# Altium schematic sheet Top.SchDoc
size A4
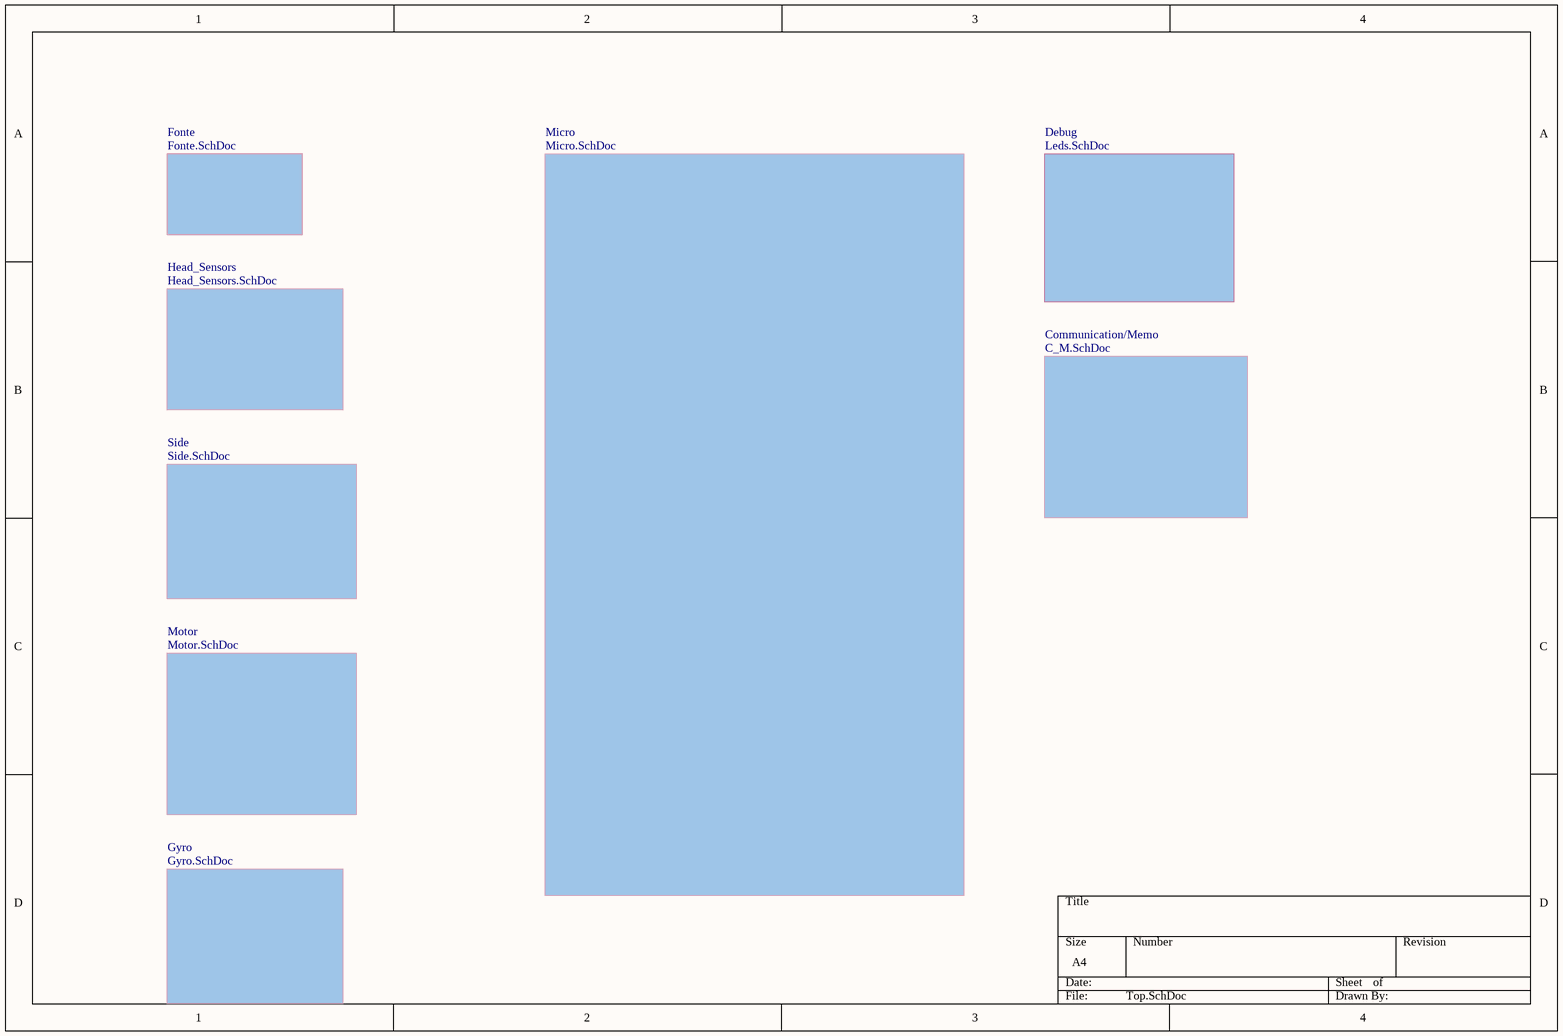
[diagram p0: Top.SchDoc]

## Sub-sheets
Communication/Memo = C_M.SchDoc: no entries
Debug = Leds.SchDoc: no entries
Fonte = Fonte.SchDoc: no entries
Gyro = Gyro.SchDoc: no entries
Head_Sensors = Head_Sensors.SchDoc: no entries
Micro = Micro.SchDoc: no entries
Motor = Motor.SchDoc: no entries
Side = Side.SchDoc: no entries